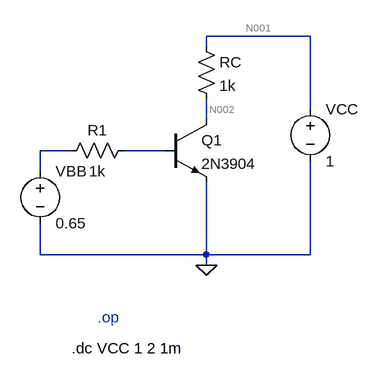
[diagram p0: schematic bjtro.asc]
bjtro.asc, the LTspice schematic file:
Version 4.1
SHEET 1 880 680
WIRE 384 -64 224 -64
WIRE 224 -48 224 -64
WIRE 384 48 384 -64
WIRE 224 64 224 32
WIRE 16 112 -32 112
WIRE 160 112 96 112
WIRE -32 144 -32 112
WIRE -32 272 -32 224
WIRE 224 272 224 160
WIRE 224 272 -32 272
WIRE 384 272 384 128
WIRE 384 272 224 272
WIRE 224 288 224 272
FLAG 224 288 0
SYMBOL npn 160 64 R0
SYMATTR InstName Q1
SYMATTR Value 2N3904
SYMBOL voltage 384 32 R0
WINDOW 123 0 0 Left 0
WINDOW 39 0 0 Left 0
SYMATTR InstName VCC
SYMATTR Value 1
SYMBOL voltage -32 128 R0
WINDOW 123 0 0 Left 0
WINDOW 39 0 0 Left 0
SYMATTR InstName VBB
SYMATTR Value 0.65
SYMBOL res 208 -64 R0
SYMATTR InstName RC
SYMATTR Value 1k
SYMBOL res 112 96 R90
WINDOW 0 0 56 VBottom 2
WINDOW 3 32 56 VTop 2
SYMATTR InstName R1
SYMATTR Value 1k
TEXT 56 368 Left 2 ;.op
TEXT 16 416 Left 2 !.dc VCC 1 2 1m

The netlist it stands for:
* bjtro.asc
Q1 N002 N004 0 0 2N3904
VCC N001 0 1
VBB N003 0 0.65
RC N001 N002 1k
R1 N004 N003 1k
.model NPN NPN
.model PNP PNP
.lib standard.bjt
* .op
.dc VCC 1 2 1m
.backanno
.end

* Results of the author's LTspice run, read from the files saved beside the schematic
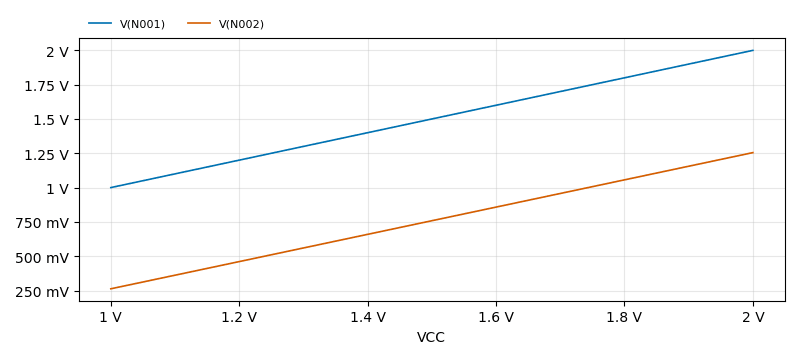
[diagram p1: DC transfer characteristic of bjtro.asc, plotted from the saved traces]
* DC transfer characteristic, 1 run:
*   V(N001): 1 V at VCC=1 V, 2 V at VCC=2 V, min 1 V, max 2 V
*   V(N002): 262.4 mV at VCC=1 V, 1.255 V at VCC=2 V, min 262.4 mV, max 1.255 V